# EAGLE design led_dimmer (EAGLE 6.5.0)
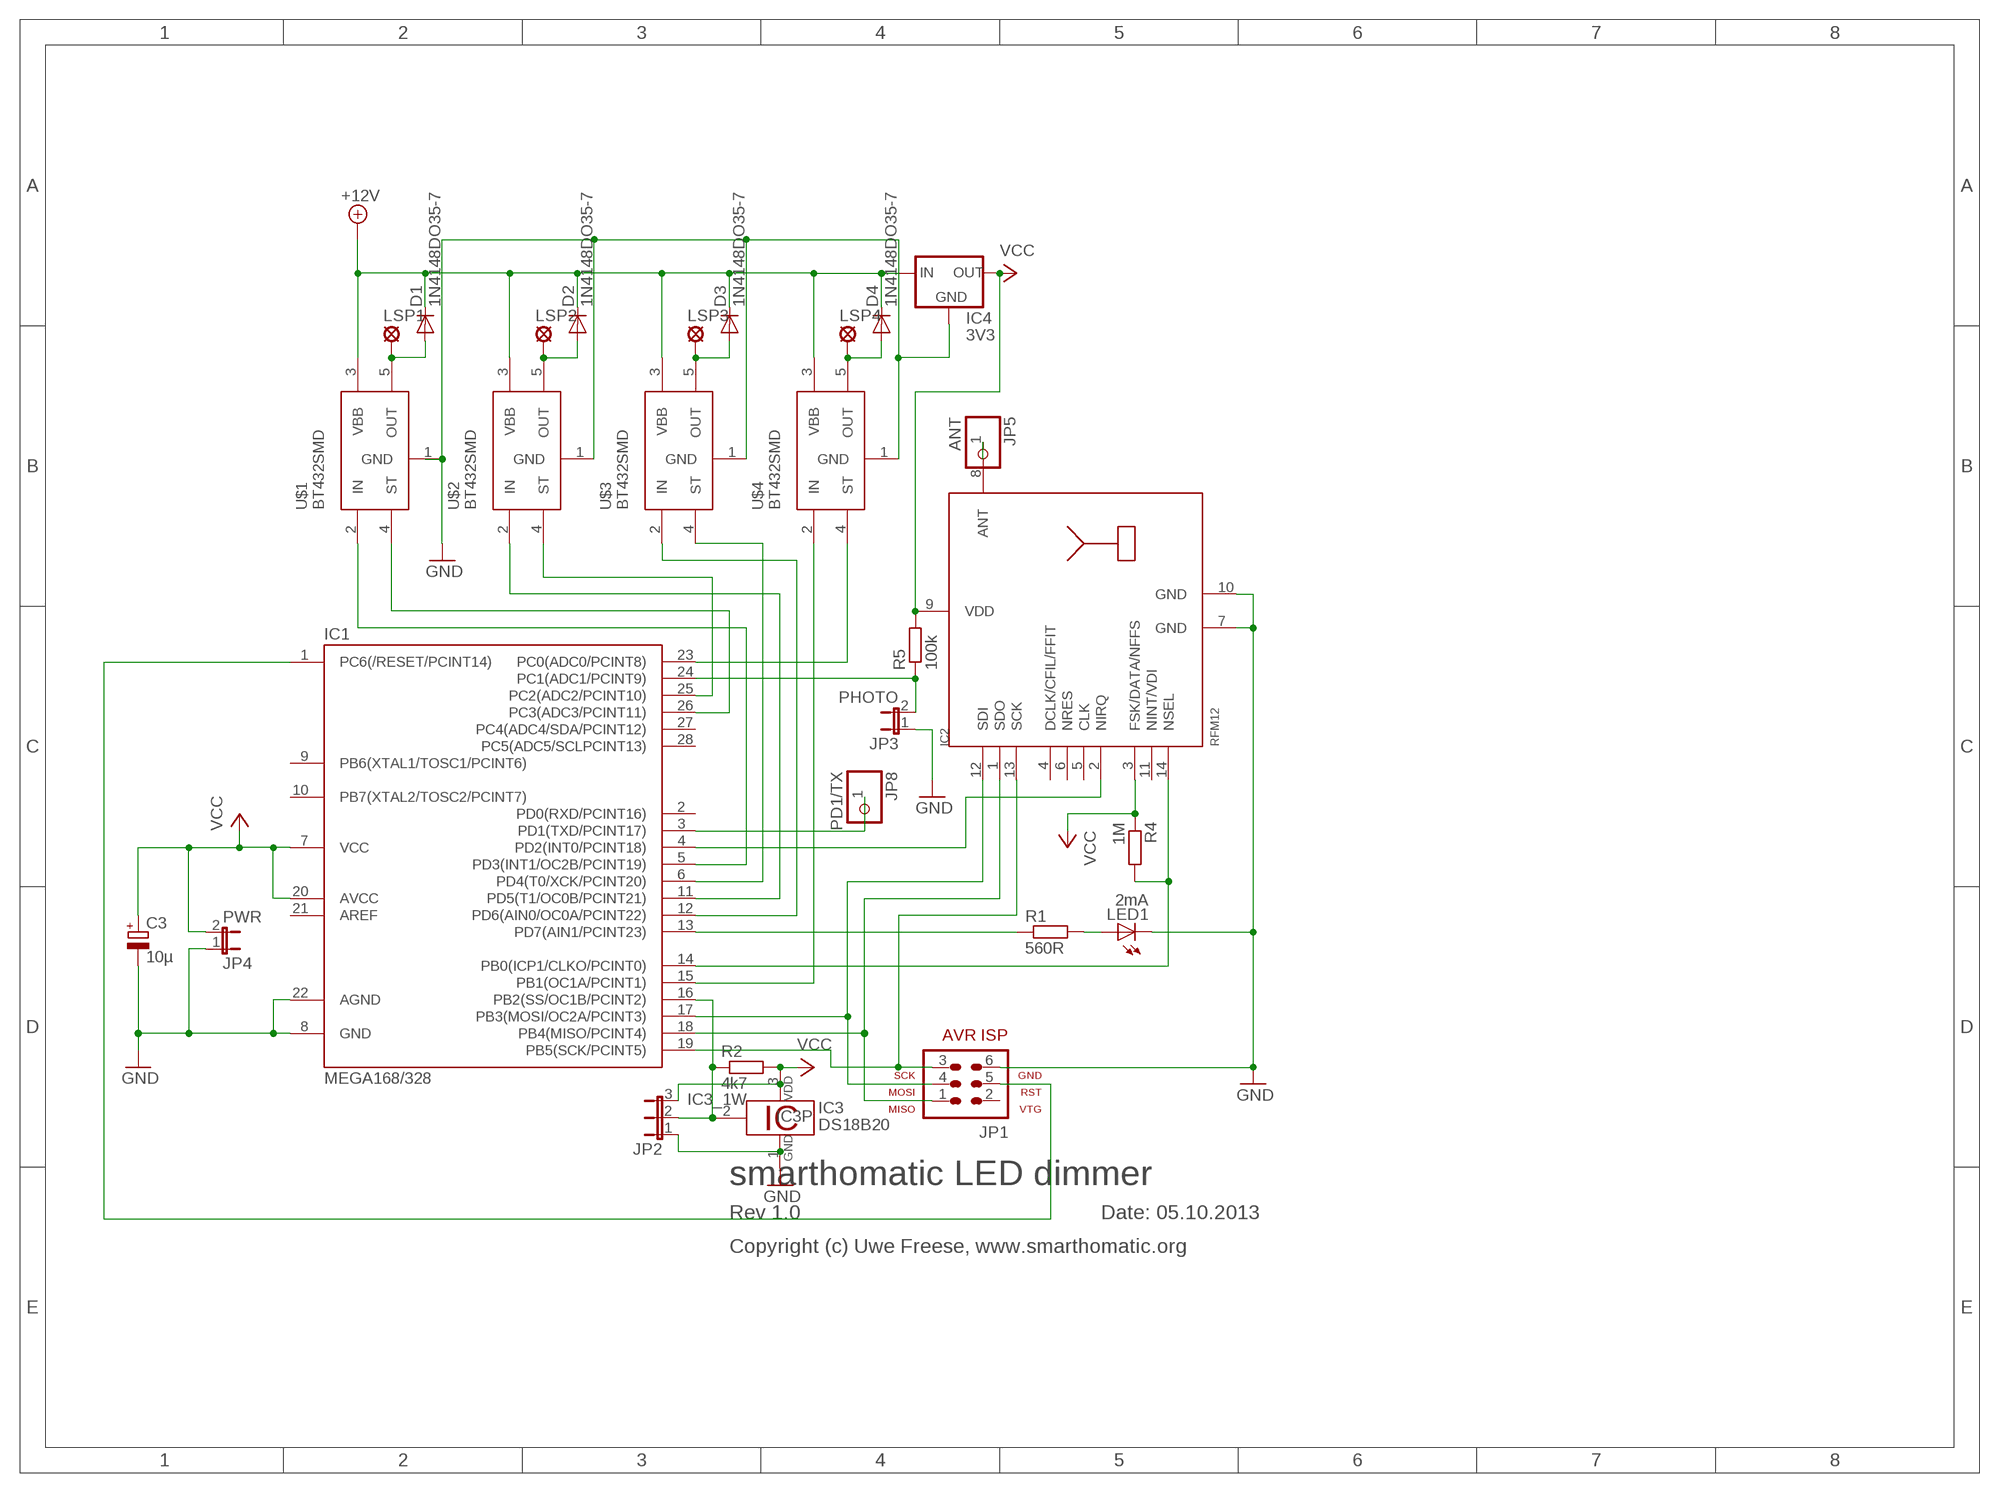
[diagram p0: schematic, sheet 1]

## Parts
C3  10µ  CPOL-EUE2.5-6  [E2,5-6]
D1  1N4148DO35-7  [DO35-7]
D2  1N4148DO35-7  [DO35-7]
D3  1N4148DO35-7  [DO35-7]
D4  1N4148DO35-7  [DO35-7]
IC1  MEGA168/328  MEGA48/88/168-PU  [DIL28-3]
IC2  RFM12  [RFM]
IC3  DS18B20  [TO92-]
IC4  3V3  78LXX  [78LXX]
JP1  AVR-ISP-6  [AVR-ISP-6]
JP2  JP2E  [JP2]
JP3  PHOTO  JP1E  [JP1]
JP4  PWR  JP1E  [JP1]
JP5  ANT  PINHD-1X1  [1X01]
JP8  PD1/TX  PINHD-1X1  [1X01]
LED1  2mA  LED3MM  [LED3MM]
LSP1  MCS10B  [MCS10B]
LSP2  MCS10B  [MCS10B]
LSP3  MCS10B  [MCS10B]
LSP4  MCS10B  [MCS10B]
R1  560R  R-EU_0207/7  [0207/7]
R2  4k7  R-EU_0207/7  [0207/7]
R4  1M  R-EU_0207/7  [0207/7]
R5  100k  R-EU_0207/7  [0207/7]
U$1  BT432SMD  [TO220-58]
U$2  BT432SMD  [TO220-58]
U$3  BT432SMD  [TO220-58]
U$4  BT432SMD  [TO220-58]

## Nets
+12V: D1.C D2.C D3.C D4.C IC4.IN U$1.3(VBB) U$2.3(VBB) U$3.3(VBB) U$4.3(VBB)
GND: C3.- IC1.8(GND) IC1.22(AGND) IC2.7(GND) IC2.10(GND) IC3.1 IC4.GND JP1.6 JP2.1 JP3.1 JP4.1 LED1.K(C) U$1.1(GND) U$2.1(GND) U$3.1(GND) U$4.1(GND)
N$1: IC1.24(PC1(ADC1/PCINT9)) JP3.2 R5.1
N$2: IC1.23(PC0(ADC0/PCINT8)) U$4.4(ST)
N$3: IC1.17(PB3(MOSI/OC2A/PCINT3)) IC2.12(SDI) JP1.4
N$4: IC1.18(PB4(MISO/PCINT4)) IC2.1(SDO) JP1.1
N$5: IC1.19(PB5(SCK/PCINT5)) IC2.13(SCK) JP1.3
N$6: IC1.13(PD7(AIN1/PCINT23)) R1.1
N$7: D1.A LSP1.MP U$1.5(OUT)
N$8: IC1.1(PC6(/RESET/PCINT14)) JP1.5
N$9: D2.A LSP2.MP U$2.5(OUT)
N$10: D3.A LSP3.MP U$3.5(OUT)
N$11: IC2.8(ANT) JP5.1
N$12: LED1.A R1.2
N$13: IC1.14(PB0(ICP1/CLKO/PCINT0)) IC2.14(NSEL) R4.2
N$14: D4.A LSP4.MP U$4.5(OUT)
N$15: IC1.4(PD2(INT0/PCINT18)) IC2.2(NIRQ)
N$16: IC1.5(PD3(INT1/OC2B/PCINT19)) U$1.2(IN)
N$17: IC1.11(PD5(T1/OC0B/PCINT21)) U$2.2(IN)
N$18: IC1.12(PD6(AIN0/OC0A/PCINT22)) U$3.2(IN)
N$19: IC1.16(PB2(SS/OC1B/PCINT2)) IC3.2 JP2.2 R2.1
N$20: IC1.3(PD1(TXD/PCINT17)) JP8.1
N$21: IC1.15(PB1(OC1A/PCINT1)) U$4.2(IN)
N$22: IC1.6(PD4(T0/XCK/PCINT20)) U$3.4(ST)
N$24: IC1.25(PC2(ADC2/PCINT10)) U$2.4(ST)
N$25: IC1.26(PC3(ADC3/PCINT11)) U$1.4(ST)
VCC: C3.+ IC1.7(VCC) IC1.20(AVCC) IC2.3(FSK/DATA/NFFS) IC2.9(VDD) IC3.3 IC4.OUT JP2.3 JP4.2 R2.2 R4.1 R5.2
Unconnected: IC1.2(PD0(RXD/PCINT16)) IC1.9(PB6(XTAL1/TOSC1/PCINT6)) IC1.10(PB7(XTAL2/TOSC2/PCINT7)) IC1.21(AREF) IC1.27(PC4(ADC4/SDA/PCINT12)) IC1.28(PC5(ADC5/SCLPCINT13)) IC2.4(DCLK/CFIL/FFIT) IC2.5(CLK) IC2.6(NRES) IC2.11(NINT/VDI) JP1.2

## Notes on the sheet
- smarthomatic LED dimmer
- Rev 1.0 | Date: 05.10.2013
- Copyright (c) Uwe Freese, www.smarthomatic.org

## Library data of the parts
C3 = rcl:CPOL-EU: POLARIZED CAPACITOR, European symbol
D1-D4 = diode:1N4148: DIODE high speed (Philips)
IC1 = avr-5-4.16:MEGA48/88/168-PU
IC2 = hopeRF:RFM12
IC3 = 1wire:DS18B20: Programmable Resolution Digital Thermometer This chip provides a onewire thermosensor with approx. 0.5°C accuracy. A programmable over/undertemperure alarm is available. The precision can be set from 9..12 bits. Notes: Vdd must be applied for accurate measurements at low temperatures, as the parasite power circuit otherwise heats the sensor. If parasite power is used, Vdd has to be connected to GND. The DS1822 is a low-cost thermometer chip, the DS18S20 is similar to the DS18B20, but with 9 Bit precision only. Author: Jan Kandziora <jjj@gmx.de>
IC4 = v-reg:78LXX: VOLTAGE REGULATOR
JP1 = avr-5-4.16:AVR-ISP-6: AVR ISP-6 Serial Programming Header
JP2 = jumper:JP2E: JUMPER
JP3 JP4 = jumper:JP1E: JUMPER
JP5 JP8 = pinhead:PINHD-1X1: PIN HEADER
LED1 = led:LED: LED OSRAM: - CHIPLED LG R971, LG N971, LY N971, LG Q971, LY Q971, LO R971, LY R971 LH N974, LH R974 LS Q976, LO Q976, LY Q976 LO Q996 - Hyper CHIPLED LW Q18S LB Q993, LB Q99A, LB R99A - SideLED LS A670, LO A670, LY A670, LG A670, LP A670 LB A673, LV A673, LT A673, LW A673 LH A674 LY A675 LS A676, LA A676, LO A676, LY A676, LW A676 LS A679, LY A679, LG A679 - Hyper Micro SIDELED® LS Y876, LA Y876, LO Y876, LY Y876 LT Y87S - SmartLED LW L88C, LW L88S LB L89C, LB L89S, LG L890 LS L89K, LO L89K, LY L89K LS L896, LA L896, LO L896, LY L896 - TOPLED LS T670, LO T670, LY T670, LG T670, LP T670 LSG T670, LSP T670, LSY T670, LOP T670, LYG T670 LG T671, LOG T671, LSG T671 LB T673, LV T673, LT T673, LW T673 LH T674 LS T676, LA T676, LO T676, LY T676, LB T676, LH T676, LSB T676, LW T676 LB T67C, LV T67C, LT T67C, LS T67K, LO T67K, LY T67K, LW E67C LS E67B, LA E67B, LO E67B, LY E67B, LB E67C, LV E67C, LT E67C LW T67C LS T679, LY T679, LG T679 LS T770, LO T770, LY T770, LG T770, LP T770 LB T773, LV T773, LT T773, LW T773 LH T774 LS E675, LA E675, LY E675, LS T675 LS T776, LA T776, LO T776, LY T776, LB T776 LHGB T686 LT T68C, LB T68C - Hyper Mini TOPLED® LB M676 - Mini TOPLED Santana® LG M470 LS M47K, LO M47K, LY M47K Source: http://www.osram.convergy.de LUXEON: - LUMILED® LXK2-PW12-R00, LXK2-PW12-S00, LXK2-PW14-U00, LXK2-PW14-V00 LXK2-PM12-R00, LXK2-PM12-S00, LXK2-PM14-U00 LXK2-PE12-Q00, LXK2-PE12-R00, LXK2-PE12-S00, LXK2-PE14-T00, LXK2-PE14-U00 LXK2-PB12-K00, LXK2-PB12-L00, LXK2-PB12-M00, LXK2-PB14-N00, LXK2-PB14-P00, LXK2-PB14-Q00 LXK2-PR12-L00, LXK2-PR12-M00, LXK2-PR14-Q00, LXK2-PR14-R00 LXK2-PD12-Q00, LXK2-PD12-R00, LXK2-PD12-S00 LXK2-PH12-R00, LXK2-PH12-S00 LXK2-PL12-P00, LXK2-PL12-Q00, LXK2-PL12-R00 Source: www.luxeon.com KINGBRIGHT: KA-3528ASYC Source: www.kingbright.com
LSP1-LSP4 = solpad:MCS10B: SOLDER PAD MC S1, distributor Buerklin, 15F505
R1 R4 R5 = rcl:R-EU_: RESISTOR, European symbol
R2 = resistor:R-EU_: RESISTOR, European symbol
U$1-U$4 = missingstuff:BT432

## Net classes
0 default: clearance 0.305 mm

## Board
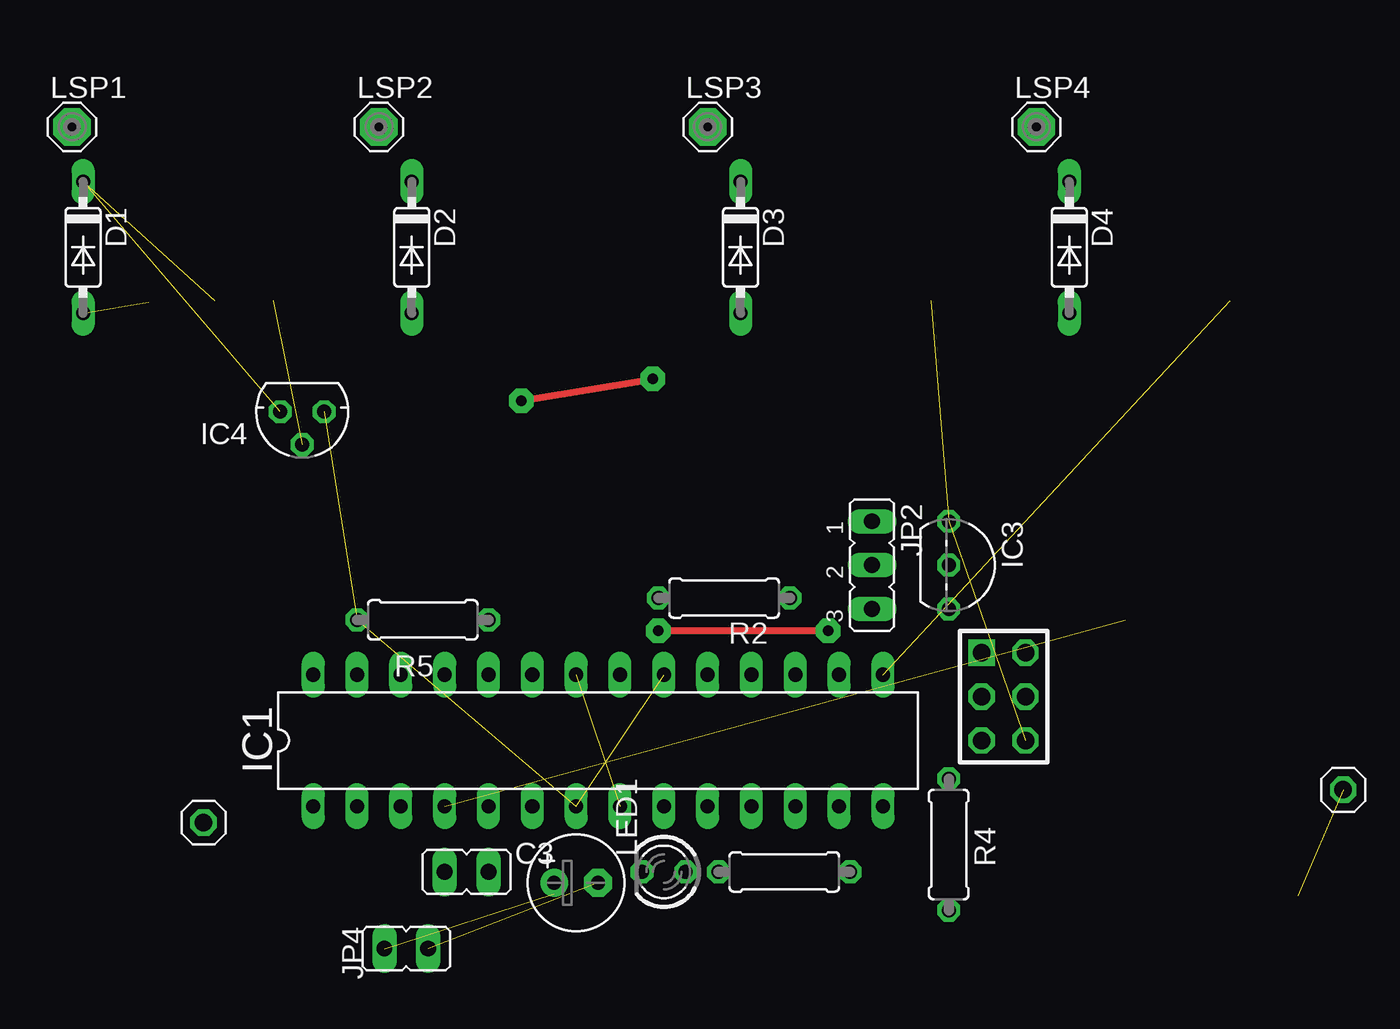
[diagram p1: board, top side]
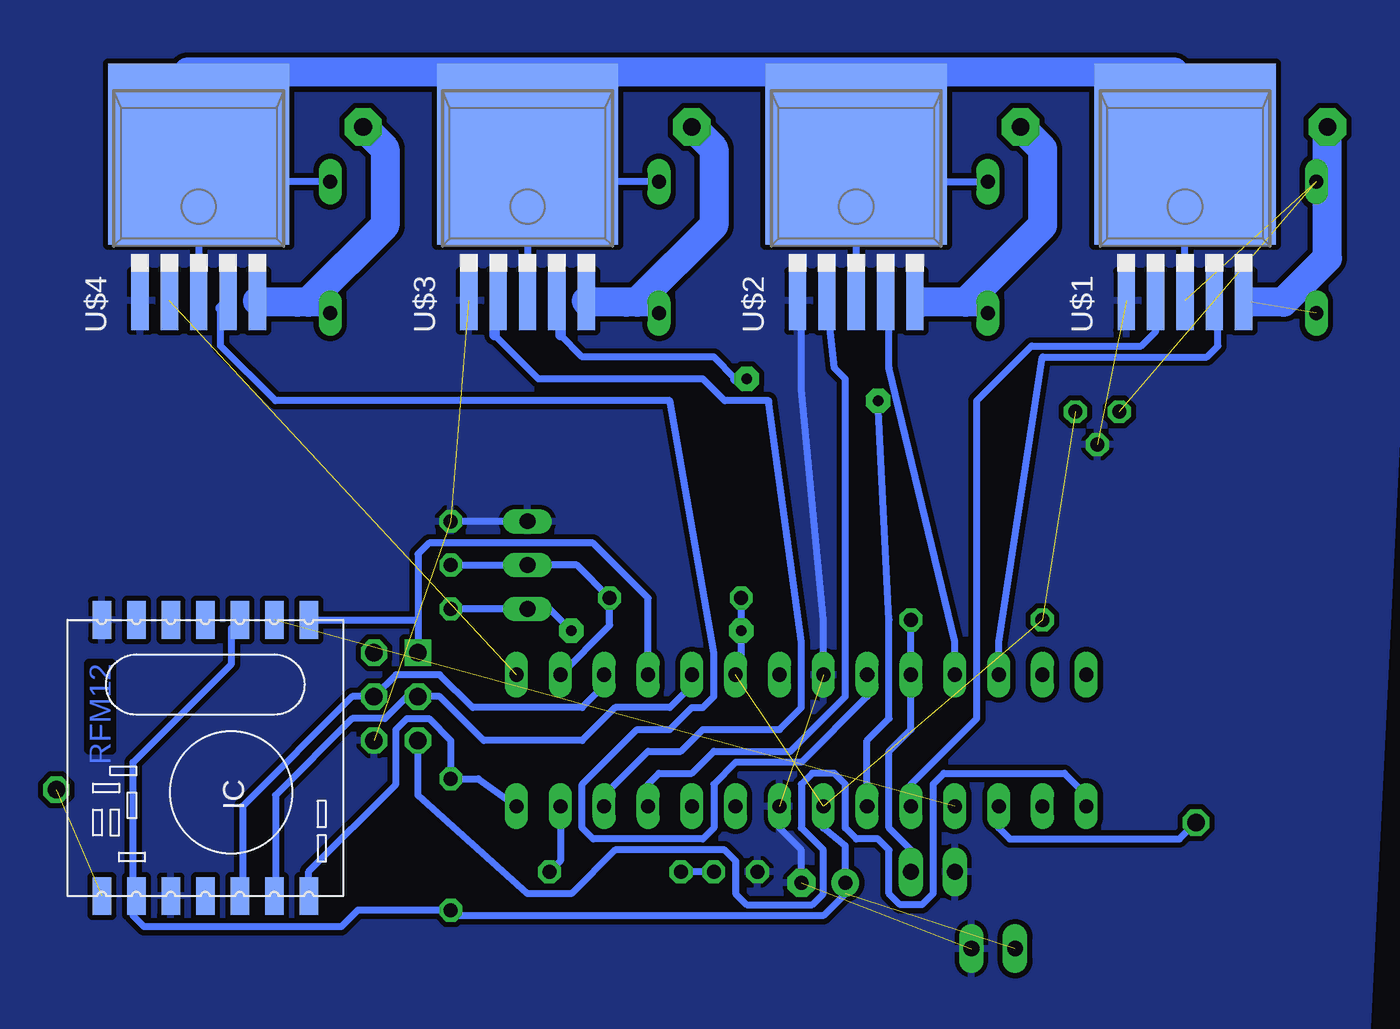
[diagram p2: board, bottom side, seen from below]

No outline drawn. Coordinates in mm, seen from the top.
Copper layers (1*16): Top 0.035mm / dielectric 1.5mm / Bottom 0.035mm
Design rules "Fusion_eagle_rule_v1.1": minimum track width 6mil, minimum drill 12mil, track to track 6mil, track to pad 6mil, pad to pad 6mil, via to via 6mil, smd to smd 0mil, copper to edge 10mil, drill to drill 10mil, minimum pad ring 10mil, minimum via ring 6mil, stop-mask expansion 2mil, vias tented up to drill 100mil, thermal gap 10mil

### Footprints (pad centres in the part's own frame; a part is rotated, then mirrored left to right if it is on the bottom)
E2,5-6 = drill 0.813 pad 1.6: + -1.27,0 | drill 0.813 pad 1.6 octagon: - 1.27,0
DO35-7 = drill 0.813 long: A 3.81,0; C -3.81,0
DIL28-3 = drill 0.813 long: 1 -16.51,-3.81; 2 -13.97,-3.81; 3 -11.43,-3.81; 4 -8.89,-3.81; 5 -6.35,-3.81; 6 -3.81,-3.81; 7 -1.27,-3.81; 8 1.27,-3.81; 9 3.81,-3.81; 10 6.35,-3.81; 11 8.89,-3.81; 12 11.43,-3.81; 13 13.97,-3.81; 14 16.51,-3.81; 15 16.51,3.81; 16 13.97,3.81; 17 11.43,3.81; 18 8.89,3.81; 19 6.35,3.81; 20 3.81,3.81; 21 1.27,3.81; 22 -1.27,3.81; 23 -3.81,3.81; 24 -6.35,3.81; 25 -8.89,3.81; 26 -11.43,3.81; 27 -13.97,3.81; 28 -16.51,3.81
RFM = smd 2.184 x 1.067: 1 0,14; 2 0,12; 3 0,10; 4 0,8; 5 0,6; 6 0,4; 7 0,2; 8 16,2; 9 16,4; 10 16,6; 11 16,8; 12 16,10; 13 16,12; 14 16,14
TO92- = drill 0.813 octagon: 1 -2.54,0; 2 0,0; 3 2.54,0
78LXX = drill 0.813 octagon: GND 0,1.905; IN 1.27,0; OUT -1.27,0
AVR-ISP-6 = drill 1.016 square: 1 -2.54,-1.27 | drill 1.016 octagon: 2 -2.54,1.27; 3 0,-1.27; 4 0,1.27; 5 2.54,-1.27; 6 2.54,1.27
JP2 = drill 0.914 long: 1 -2.54,0; 2 0,0; 3 2.54,0
JP1 = drill 0.914 long: 1 0,-1.27; 2 0,1.27
1X01 = drill 1.016 octagon: 1 0,0
LED3MM = drill 0.813 octagon: A -1.27,0; K 1.27,0
MCS10B = drill 1.016 pad 2.159 octagon: MP 0,0
0207/7 = drill 0.813 octagon: 1 -3.81,0; 2 3.81,0
TO220-58 = smd 1 x 3.4: 1 -3.4,-5; 2 -1.7,-5; 3 0,-5; 4 1.7,-5; 5 3.4,-5 | smd 10.5 x 10.5: 6 0,3.5

### Placement (x,y rotation side)
C3  29.84,37.47 0 top
D1  1.27,74.3 270 top
D2  20.32,74.3 270 top
D3  39.37,74.3 270 top
D4  58.42,74.3 270 top
IC1  31.11,45.72 0 top
IC2  73.66,52.7 270 bottom
IC3  51.44,55.88 270 top
IC4  13.97,64.77 180 top
JP1  54.61,48.26 270 top
JP2  46.99,55.88 270 top
JP3  23.5,38.1 270 top
JP4  20,33.66 90 top
JP5  74.3,42.86 270 top
JP8  8.26,40.96 0 top
LED1  34.92,38.1 180 top
LSP1  0.64,81.28 0 top
LSP2  18.41,81.28 0 top
LSP3  37.47,81.28 0 top
LSP4  56.52,81.28 0 top
R1  41.91,38.1 180 top
R2  38.42,53.98 180 top
R4  51.44,39.69 90 top
R5  20.95,52.7 180 top
U$1  8.89,76.2 0 bottom
U$2  27.94,76.2 0 bottom
U$3  46.99,76.2 0 bottom
U$4  66.04,76.2 0 bottom

### Tracks (layer width: path | path; a pad name or v marks a point on that pad's centre or on a via)
+12V  (2 unrouted)
  Bottom 0.406: 27.94,78.11 D2.C | U$1.3 8.89,82.55 10.79,84.45 27.94,84.45 | 27.94,84.45 27.94,78.11 | U$2.3 27.94,78.11 | 27.94,84.45 46.99,84.45 | 46.99,78.74 U$3.3 | D3.C 46.35,78.11 46.99,78.74 | D4.C 62.23,78.11 | 62.23,78.11 66.04,78.11 U$4.3 | 46.99,78.74 46.99,84.45 | 46.99,84.45 62.23,84.45 62.23,78.11
GND  (5 unrouted)
  Bottom 0.406: IC1.22 29.84,52.7 31.11,66.04 31.11,70.97 U$2.1 | JP2.1 IC3.1 | C3.- 31.11,39.37 32.38,40.64 IC1.8
  pour Bottom: -4.76,91.12 99.06,87.95 100.97,0.95 -0.32,0.95
N$1
  Bottom 0.406: R5.1 IC1.24 24.77,46.35 26.04,45.09 26.04,40.64 24.77,39.37 JP3.2
N$2
  Bottom 0.406: IC1.23 27.3,48.26 31.11,44.45 34.92,44.45 36.2,43.18 36.2,40.64 36.83,40.01 43.18,40.01 43.81,40.64 43.81,43.18 40.64,46.35 38.73,46.35 37.47,47.62 36.83,47.62 36.2,48.26 36.2,50.8 38.73,65.41 61.59,65.41 64.77,68.58 64.77,70.77
  Bottom 0.61: 64.77,70.77 U$4.4
N$3
  Bottom 0.406: IC2.12 63.5,36.87 63.5,41.91 57.15,48.26 JP1.4 54.61,49.53 52.07,49.53 50.16,47.62 43.81,47.62 42.55,48.9 IC1.17
N$4
  Bottom 0.406: IC1.18 40.01,53.98 43.18,57.15 52.7,57.15 53.34,56.52 53.34,52.7 | 53.34,52.7 JP1.1 | IC2.1 53.34,52.7
N$5
  Bottom 0.406: IC1.19 37.47,48.9 38.73,47.62 41.91,47.62 43.81,45.72 49.53,45.72 52.07,48.26 JP1.3 53.98,48.26 55.24,46.99 57.15,46.99 61.59,42.55 61.59,36.77 IC2.13
N$6
  Bottom 0.406: IC1.13 45.09,38.73 R1.1
N$7  (1 unrouted)
  Bottom 0.406: U$1.5 5.16,71.2 5.08,71.12 3.17,71.12 3.1,71.2
  Bottom 1.676: 3.1,71.2 0.64,73.66 LSP1.MP
N$8
  Bottom 0.406: 14.61,41.27 IC1.1 14.61,42.55 15.88,43.81 22.86,43.81 23.5,43.18 23.5,36.83 24.13,36.2 25.4,36.2 26.04,36.83 26.04,39.37 26.67,40.01 27.94,40.01 28.57,40.64 28.57,43.18 29.21,43.81 30.48,43.81 31.11,43.18 31.11,40.64 29.84,39.37 29.84,36.83 30.48,36.2 34.29,36.2 34.92,36.83 34.92,38.73 35.56,39.37 41.91,39.37 44.45,36.83 46.99,36.83 53.34,42.55 JP1.5
N$9
  Bottom 0.406: D2.A 24.54,70.48 U$2.5 24.54,71.12 24.13,71.12
  Bottom 1.676: LSP2.MP 17.14,80.01 17.14,75.56 21.59,71.12 24.13,71.12
N$10
  Bottom 0.406: D3.A 40.64,70.48 41.27,71.12
  Bottom 1.676: LSP3.MP 36.2,80.01 36.2,75.56 40.64,71.12 41.27,71.12 43.51,71.12 U$3.5
N$11  (1 unrouted)
N$12
  Bottom 0.406: LED1.A R1.2
N$13
  Bottom 0.406: IC1.14 49.85,43.5 R4.2 51.44,45.72 52.7,46.99 53.98,46.99 54.61,46.35 54.61,43.18 59.66,38.13 IC2.14
N$14
  Bottom 0.406: D4.A 59.69,70.48 60.33,71.12
  Bottom 1.676: LSP4.MP 55.24,80.01 55.24,75.56 59.69,71.12 60.33,71.12 62.56,71.12 U$4.5
N$15  (1 unrouted)
N$16
  Bottom 0.406: IC1.5 24.77,43.18 20.95,46.99 20.95,65.41 17.78,68.58 11.43,68.58 10.59,69.42 U$1.2
N$17
  Bottom 0.406: IC1.11 40.01,43.18 39.37,43.81 37.47,43.81 36.2,45.09 31.75,45.09 28.57,48.26 28.57,66.67 29.21,67.31 U$2.2
N$18
  Bottom 0.406: IC1.12 42.55,42.55 40.01,45.09 38.1,45.09 36.83,46.35 32.38,46.35 31.11,47.62 31.11,51.44 33.02,65.41 35.56,65.41 36.83,66.67 46.35,66.67 48.9,69.22
  Bottom 0.61: 48.9,69.22 48.9,71 U$3.2
N$19
  Bottom 0.406: IC3.2 JP2.2 44.13,55.88 R2.1 42.23,52.39 IC1.16
N$20
  Bottom 0.406: IC1.3 19.68,40.64 19.05,40.01 9.21,40.01 JP8.1
N$21  (1 unrouted)
N$22  (via drill 0.6 pad 1.42)
  Top 0.406: v26.67,65.41 v34.29,66.67
  Bottom 0.406: IC1.6 27.3,45.72 26.04,46.99 26.04,52.7 v26.67,65.41 | 34.92,66.67 36.2,67.94 43.81,67.94 45.09,69.22
  Bottom 0.61: v34.29,66.67 34.92,66.67 | 45.09,69.22 45.09,71 U$3.4
N$23
  Bottom 1.676: 3.17,71.12 5.08,71.12
N$24
  Bottom 0.406: IC1.25 22.23,51.44 26.04,67.31 26.04,71
  Bottom 0.61: 26.04,71 U$2.4
N$25
  Bottom 0.406: IC1.26 19.68,51.44 17.14,67.94 7.62,67.94 6.99,68.58 6.99,71
  Bottom 0.61: 6.99,71 U$1.4
N$26
  Bottom 1.676: 8.89,83.82 9.53,84.45 66.67,84.45
N$27
  Bottom 0.406: 8.89,71.12 8.89,79.38
VCC  (via drill 0.6 pad 1.42)  (4 unrouted)
  Top 0.406: v44.45,52.07 v34.61,52.07
  Bottom 0.406: R2.2 v34.61,52.07 34.61,49.85 IC1.20 | IC3.3 JP2.3 45.72,53.34 v44.45,52.07 | IC1.7 29.84,40.64 28.57,39.62 C3.+ 28.57,36.83 29.84,35.56 51.12,35.56 R4.1 56.83,35.88 57.78,34.92 69.22,34.92 69.85,35.56 69.85,36.52 IC2.9 69.85,36.7 69.85,44.45 64.14,50.16 64.14,52.23 IC2.3